# EAGLE schematic Programator_v1 (EAGLE 5.06)
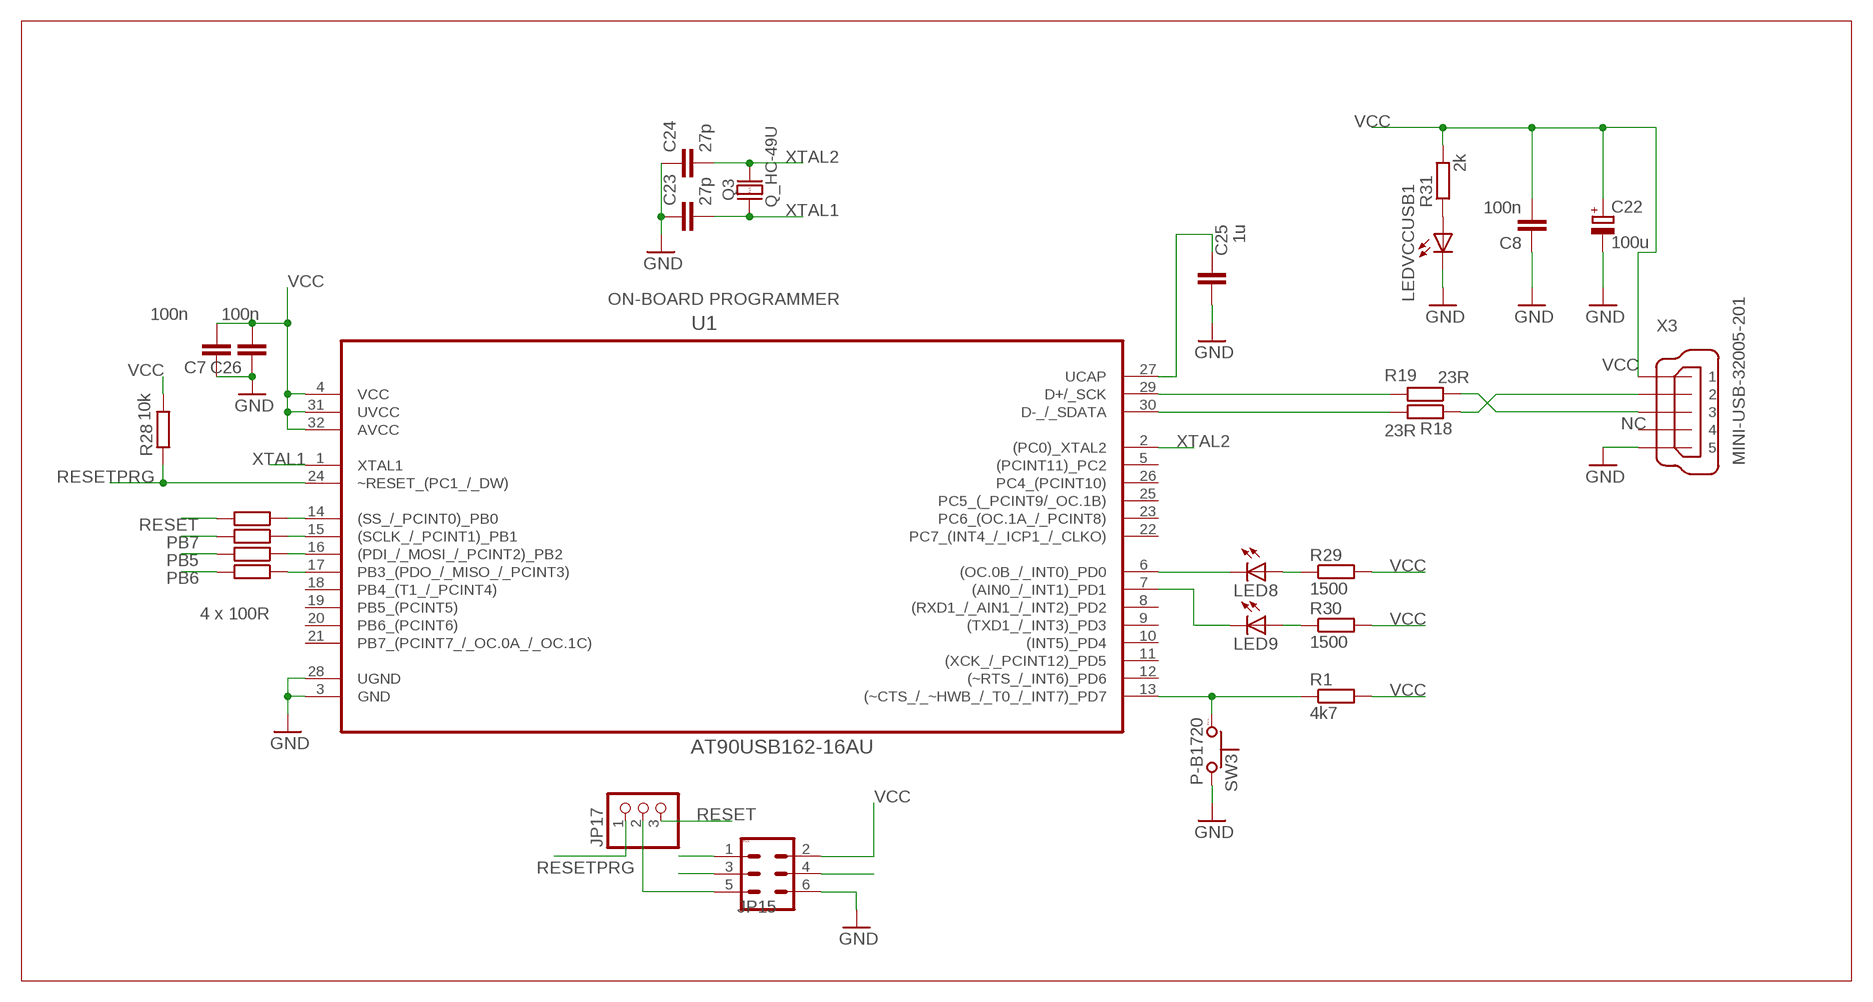
[diagram p0: schematic, sheet 1]

## Parts
9  100  R-EU_M1206  [M1206]
10  100  R-EU_M1206  [M1206]
11  100  R-EU_M1206  [M1206]
12  100  R-EU_M1206  [M1206]
C7  100n  C-EUC1206  [C1206]
C8  100n  C-EUC1206  [C1206]
C22  100u  CPOL-EUE2.5-7  [E2,5-7]
C23  27p  C-EUC1206  [C1206]
C24  27p  C-EUC1206  [C1206]
C25  1u  C-EUC1206  [C1206]
C26  100n  C-EUC1206  [C1206]
JP15  MLW06  [MLW06G]
JP17  PINHD-1X3  [1X03]
LED8  LEDSMT1206  [1206]
LED9  LEDSMT1206  [1206]
LEDVCCUSB1  LEDSMT1206  [1206]
Q3  Q_HC-49U  [HC-49U]
R1  4k7  R-EU_M1206  [M1206]
R18  23R  R-EU_M1206  [M1206]
R19  23R  R-EU_M1206  [M1206]
R28  10k  R-EU_M1206  [M1206]
R29  1500  R-EU_M0805  [M0805]
R30  1500  R-EU_M0805  [M0805]
R31  2k  R-EU_M1206  [M1206]
SW3  P-B1720  [P-B1720]
U1  AT90USB162-16AU  [QFP80P900X900X120-32N]
X3  MINI-USB-32005-201  [32005-201]

## Nets
GND: C7.1 C8.1 C22.- C23.1 C24.1 C25.1 C26.1 JP15.6 LEDVCCUSB1.C SW3.2 U1.3(GND) U1.28(UGND) X3.5
N1: JP15.5 JP17.2
N$1: C25.2 U1.27(UCAP)
N$6: R1.1 SW3.1 U1.13((~CTS_/_~HWB_/_T0_/_INT7)_PD7)
N$62: R18.2 U1.30(D-_/_SDATA)
N$64: R18.1 X3.2
N$65: R19.1 X3.3
N$66: R19.2 U1.29(D+/_SCK)
N$68: LED8.C U1.6((OC.0B_/_INT0)_PD0)
N$69: LED8.A R29.1
N$70: LED9.A R30.1
N$71: LED9.C U1.7((AIN0_/_INT1)_PD1)
N$72: 9.1 U1.14((SS_/_PCINT0)_PB0)
N$73: 10.1 U1.15((SCLK_/_PCINT1)_PB1)
N$74: 11.1 U1.16((PDI_/_MOSI_/_PCINT2)_PB2)
N$75: 12.1 U1.17(PB3_(PDO_/_MISO_/_PCINT3))
N$76: LEDVCCUSB1.A R31.1
PB5: 11.2 JP15.4
PB6: 12.2 JP15.1
PB7: 10.2 JP15.3
RESET: 9.2 JP17.3
RESETPRG: JP17.1 R28.1 U1.24(~RESET_(PC1_/_DW))
VCC: C7.2 C8.2 C22.+ C26.2 JP15.2 R1.2 R28.2 R29.2 R30.2 R31.2 U1.4(VCC) U1.31(UVCC) U1.32(AVCC) X3.1
XTAL1: C23.2 Q3.1 U1.1(XTAL1)
XTAL2: C24.2 Q3.2 U1.2((PC0)_XTAL2)
Unconnected: SW3.3 SW3.4 U1.5((PCINT11)_PC2) U1.8((RXD1_/_AIN1_/_INT2)_PD2) U1.9((TXD1_/_INT3)_PD3) U1.10((INT5)_PD4) U1.11((XCK_/_PCINT12)_PD5) U1.12((~RTS_/_INT6)_PD6) U1.18(PB4_(T1_/_PCINT4)) U1.19(PB5_(PCINT5)) U1.20(PB6_(PCINT6)) U1.21(PB7_(PCINT7_/_OC.0A_/_OC.1C)) U1.22(PC7_(INT4_/_ICP1_/_CLKO)) U1.23(PC6_(OC.1A_/_PCINT8)) U1.25(PC5_(_PCINT9/_OC.1B)) U1.26(PC4_(PCINT10)) X3.4

## Notes on the sheet
- ON-BOARD PROGRAMMER
- NC
- 4 x 100R

## Library data of the parts
9-12 R1 R18 R19 R28-R31 = resistor:R-EU_: RESISTOR, European symbol
C7 C8 C23-C26 = resistor:C-EU: CAPACITOR, European symbol
C22 = resistor:CPOL-EU: POLARIZED CAPACITOR, European symbol
JP15 = #PaJa_konektory:MLW06: Konektory MLW - vidlice - 6x
JP17 = pinhead:PINHD-1X3: PIN HEADER
LED8 LED9 LEDVCCUSB1 = led:LED: LED OSRAM: - CHIPLED LG R971, LG N971, LY N971, LG Q971, LY Q971, LO R971, LY R971 LH N974, LH R974 LS Q976, LO Q976, LY Q976 LO Q996 - Hyper CHIPLED LW Q18S LB Q993, LB Q99A, LB R99A - SideLED LS A670, LO A670, LY A670, LG A670, LP A670 LB A673, LV A673, LT A673, LW A673 LH A674 LY A675 LS A676, LA A676, LO A676, LY A676, LW A676 LS A679, LY A679, LG A679 - Hyper Micro SIDELED® LS Y876, LA Y876, LO Y876, LY Y876 LT Y87S - SmartLED LW L88C, LW L88S LB L89C, LB L89S, LG L890 LS L89K, LO L89K, LY L89K LS L896, LA L896, LO L896, LY L896 - TOPLED LS T670, LO T670, LY T670, LG T670, LP T670 LSG T670, LSP T670, LSY T670, LOP T670, LYG T670 LG T671, LOG T671, LSG T671 LB T673, LV T673, LT T673, LW T673 LH T674 LS T676, LA T676, LO T676, LY T676, LB T676, LH T676, LSB T676, LW T676 LB T67C, LV T67C, LT T67C, LS T67K, LO T67K, LY T67K, LW E67C LS E67B, LA E67B, LO E67B, LY E67B, LB E67C, LV E67C, LT E67C LW T67C LS T679, LY T679, LG T679 LS T770, LO T770, LY T770, LG T770, LP T770 LB T773, LV T773, LT T773, LW T773 LH T774 LS E675, LA E675, LY E675, LS T675 LS T776, LA T776, LO T776, LY T776, LB T776 LHGB T686 LT T68C, LB T68C - Hyper Mini TOPLED® LB M676 - Mini TOPLED Santana® LG M470 LS M47K, LO M47K, LY M47K Source: http://www.osram.convergy.de LUXEON: - LUMILED® LXK2-PW12-R00, LXK2-PW12-S00, LXK2-PW14-U00, LXK2-PW14-V00 LXK2-PM12-R00, LXK2-PM12-S00, LXK2-PM14-U00 LXK2-PE12-Q00, LXK2-PE12-R00, LXK2-PE12-S00, LXK2-PE14-T00, LXK2-PE14-U00 LXK2-PB12-K00, LXK2-PB12-L00, LXK2-PB12-M00, LXK2-PB14-N00, LXK2-PB14-P00, LXK2-PB14-Q00 LXK2-PR12-L00, LXK2-PR12-M00, LXK2-PR14-Q00, LXK2-PR14-R00 LXK2-PD12-Q00, LXK2-PD12-R00, LXK2-PD12-S00 LXK2-PH12-R00, LXK2-PH12-S00 LXK2-PL12-P00, LXK2-PL12-Q00, LXK2-PL12-R00 Source: www.luxeon.com KINGBRIGHT: KA-3528ASYC Source: www.kingbright.com
Q3 = #PaJa_22:Q_HC-49U: Krystal - 1MHz - 48MHz
SW3 = #PaJa_prepinace:P-B1720: µ-tlacitko
U1 = at90,:AT90USB162-16AU: 8-bit Microcontroller; MPN: AT90USB162-16AU; OC_FARNELL: 1455073; OC_NEWARK: 58M3868; PACKAGE: TQFP-32; SUPPLIER: Atmel
X3 = con-cypressindustries:MINI-USB-: MINI USB-B Conector Source: www.cypressindustries.com